# Altium schematic sheet XTAL-8M.SchDoc
size A4
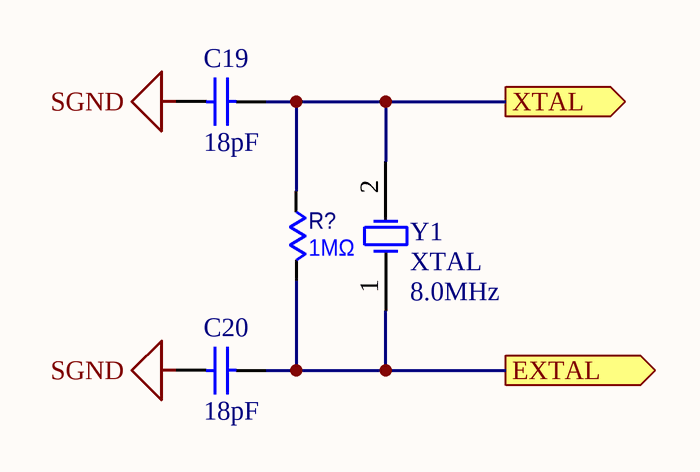
[diagram p0: XTAL-8M.SchDoc]

## Parts
C19  value 18pF  [0603]  (hidden comment: Cap)
C20  value 18pF  [0603]  (hidden comment: Cap)
R?  value 1MΩ  [0805]  (hidden comment: Res)
Y1  XTAL  value 8.0MHz  [XTAL]

## Ports
EXTAL (out), XTAL (out)

## Nets
SGND: C19.2 C20.2
EXTAL: C20.1 R?.2 Y1.1(OSC1) ; port EXTAL
XTAL: C19.1 R?.1 Y1.2(OSC2) ; port XTAL

## Library data of the parts
C19 C20 = Cap: 无极性电容; Published: 8-Jun-2000; LatestRevisionDate: 17-Jul-2002; LatestRevisionNote: Re-released for DXP Platform.; PackageReference: RAD-0.3; Publisher: Altium Limited
R? = Res: 常规电阻
Y1 = XTAL: Crystal Oscillator; Published: 8-Jun-2000; LatestRevisionDate: 17-Jul-2002; LatestRevisionNote: Re-released for DXP Platform.; PackageReference: R38; Publisher: Altium Limited; PackageDescription: Crystal, Thru-Hole; 2 Leads; Body 3.1 x 8.2 mm (Dia.xH)